# Altium schematic sheet 24LC00T_EEPROM.SchDoc: 24LC00T EEPROM
size A4
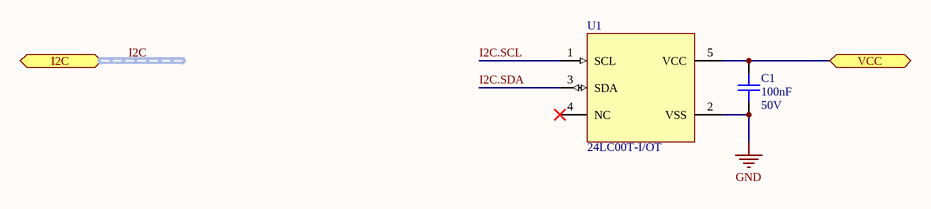
[diagram p0: 24LC00T_EEPROM.SchDoc]

## Parts
C1  Capacitance: 100nF  Voltage: 50V  [C0402]  (hidden comment: CAP CER 0.1UF 50V X7R 0402)
U1  24LC00T-I/OT  [SOT-23-5]

## Ports
I2C (harness I2C), VCC

## Nets
GND: C1.1 U1.2(VSS)
I2C.SCL: U1.1(SCL)
I2C.SDA: U1.3(SDA)
VCC: C1.2 U1.5(VCC) ; port VCC

Not connected (* = marked no-connect by the designer): U1 4(NC)*

## Buses and harness runs
harness I2C = port I2C

## Notes on the sheet
- Title
- Size:
- Date:
- A4
- Number:
- Time:
- Revision:
- Sheet
- of
- File:

## Library data of the parts
C1 = CAP CER 0.1UF 50V X7R 0402: 0.1µF ±10% 50V Ceramic Capacitor X7R 0402 (1005 Metric); Manufacturer Part Number: CGA2B3X7R1H104K050BB; Manufacturer: TDK; Supplier 1: Digi-Key; Stock 1: 2925303; Pricing 1: 1=0.17, 10=0.118, 50=0.0668, 100=0.0553, 500=0.0388, 1000=0.0321, 2500=0.0299, 5000=0.0273 (USD); Mount: Surface Mount; Case Code (Metric): 1005; Case Code (Imperial): 0402; Min Operating Temperature: -55°C; Max Operating Temperature: 125°C; Tolerance: 10%; Dielectric: X7R; Voltage Rating: 50V; Voltage Rating (DC): 50V; Packaging: Tape and Reel; Package Quantity: 1; Termination: SMD/SMT; Composition: Ceramic; Length: 1mm; Height: 0.5mm; Width: 0.02inch; Thickness: 0.022inch; Depth: 0.5mm; REACH SVHC: No SVHC; Lead Free: Lead Free; ComponentLink1URL: http://product.tdk.com/capacitor/mlcc/en/documents/mlccspec_automotive_general_midvoltage_en.pdf?src-supplier=Future+Electronics; ComponentLink1Description: http://product.tdk.com/capacitor/mlcc/en/documents/mlccspec_automotive_general_midvoltage_en.pdf?src-supplier=Future+Electronics; ComponentLink2URL: http://www.farnell.com/datasheets/1807242.pdf?src-supplier=Element14; ComponentLink2Description: http://www.farnell.com/datasheets/1807242.pdf?src-supplier=Element14; ComponentLink3URL: http://www.mouser.com/ds/2/400/lcc_automotive_general_en-843974.pdf?src-supplier=Mouser; ComponentLink3Description: http://www.mouser.com/ds/2/400/lcc_automotive_general_en-843974.pdf?src-supplier=Mouser; ComponentLink4URL: http://www.farnell.com/datasheets/1936565.pdf?src-supplier=Element14; ComponentLink4Description: http://www.farnell.com/datasheets/1936565.pdf?src-supplier=Element14; ComponentLink5URL: http://www.farnell.com/datasheets/1735392.pdf?src-supplier=Element14; ComponentLink5Description: http://www.farnell.com/datasheets/1735392.pdf?src-supplier=Element14; Supplier Part Number 1: 445-6899-1-ND; Case/Package: 0402; Weight: 2.3E-05oz; Ratings: AEC-Q200
U1 = IC 24LC00T-I/OT EEPROM 128 I2C SOT23-5: EEPROM Memory IC 128b (16 x 8) I²C 400kHz 3500ns SOT-23-5; Manufacturer: Microchip; Min Supply Voltage: 2.5V; Max Supply Voltage: 5.5V; Interface: I2C,2-Wire,Serial; Access Time: 900ns; Nominal Supply Current: 2mA; Supplier 1: Digi-Key; Manufacturer Part Number: 24LC00T-I/OT; Stock 1: 29747; Pricing 1: 1=0.19, 100=0.1785 (USD); Mount: Surface Mount; Case/Package: SOT-23; Number of Pins: 5; Contact Plating: Tin,Matte; Min Operating Temperature: -40°C; Max Operating Temperature: 85°C; Density: 128b; Frequency: 400kHz; Packaging: Tape and Reel; Package Quantity: 3000; Memory Type: EEPROM; Memory Size: 128b; Max Frequency: 400kHz; Length: 3.1mm; Height: 1.3mm; Width: 1.8mm; Radiation Hardening: No; REACH SVHC: No SVHC; Lead Free: Lead Free; ComponentLink1URL: http://www.farnell.com/datasheets/1669367.pdf?src-supplier=Element14; ComponentLink1Description: http://www.farnell.com/datasheets/1669367.pdf?src-supplier=Element14; ComponentLink2URL: http://ww1.microchip.com/downloads/en/DeviceDoc/21178H.pdf?src-supplier=Avnet+Europe; ComponentLink2Description: http://ww1.microchip.com/downloads/en/DeviceDoc/21178H.pdf?src-supplier=Avnet+Europe; ComponentLink3URL: http://www.microchip.com/mymicrochip/filehandler.aspx?ddocname=en011773&src-supplier=Future+Electronics; ComponentLink3Description: http://www.microchip.com/mymicrochip/filehandler.aspx?ddocname=en011773&src-supplier=Future+Electronics; ComponentLink4URL: https://www.distrelec.biz/Web/Downloads/_t/ds/24AA00_24LC00_24C00_eng_tds.pdf?mime=application%2Fpdf&src-supplier=Distrelec; ComponentLink4Description: https://www.distrelec.biz/Web/Downloads/_t/ds/24AA00_24LC00_24C00_eng_tds.pdf?mime=application%2Fpdf&src-supplier=Distrelec; ComponentLink5URL: https://www.verical.com/server-webapp/html/getDatasheet?partID=790518&src-supplier=Verical; ComponentLink5Description: https://www.verical.com/server-webapp/html/getDatasheet?partID=790518&src-supplier=Verical; ComponentLink6URL: http://www.produktinfo.conrad.com/datenblaetter/1000000-1099999/001085284-da-01-en-IC_EEPROM_128B_24LC00T_I_OT_SOT_23_5_MCP.pdf?src-supplier=Conrad; ComponentLink6Description: http://www.produktinfo.conrad.com/datenblaetter/1000000-1099999/001085284-da-01-en-IC_EEPROM_128B_24LC00T_I_OT_SOT_23_5_MCP.pdf?src-supplier=Conrad; Supplier Part Number 1: 24LC00T-I/OTCT-ND